# Altium schematic sheet Sheet2.SchDoc
size 420 x 297 mm; Author: ALTIUM GOSTBOM2.0 KEV; SheetNumber: 1; SheetTotal: 1; Наименование1: Логический анализатор; Наименование2: интерфейсов физического; Наименование3: уровня; Вид_документа_SCH: Схема электрическая принципиальная; Обозначение_Код: ТОИУ.001002.001 Э3
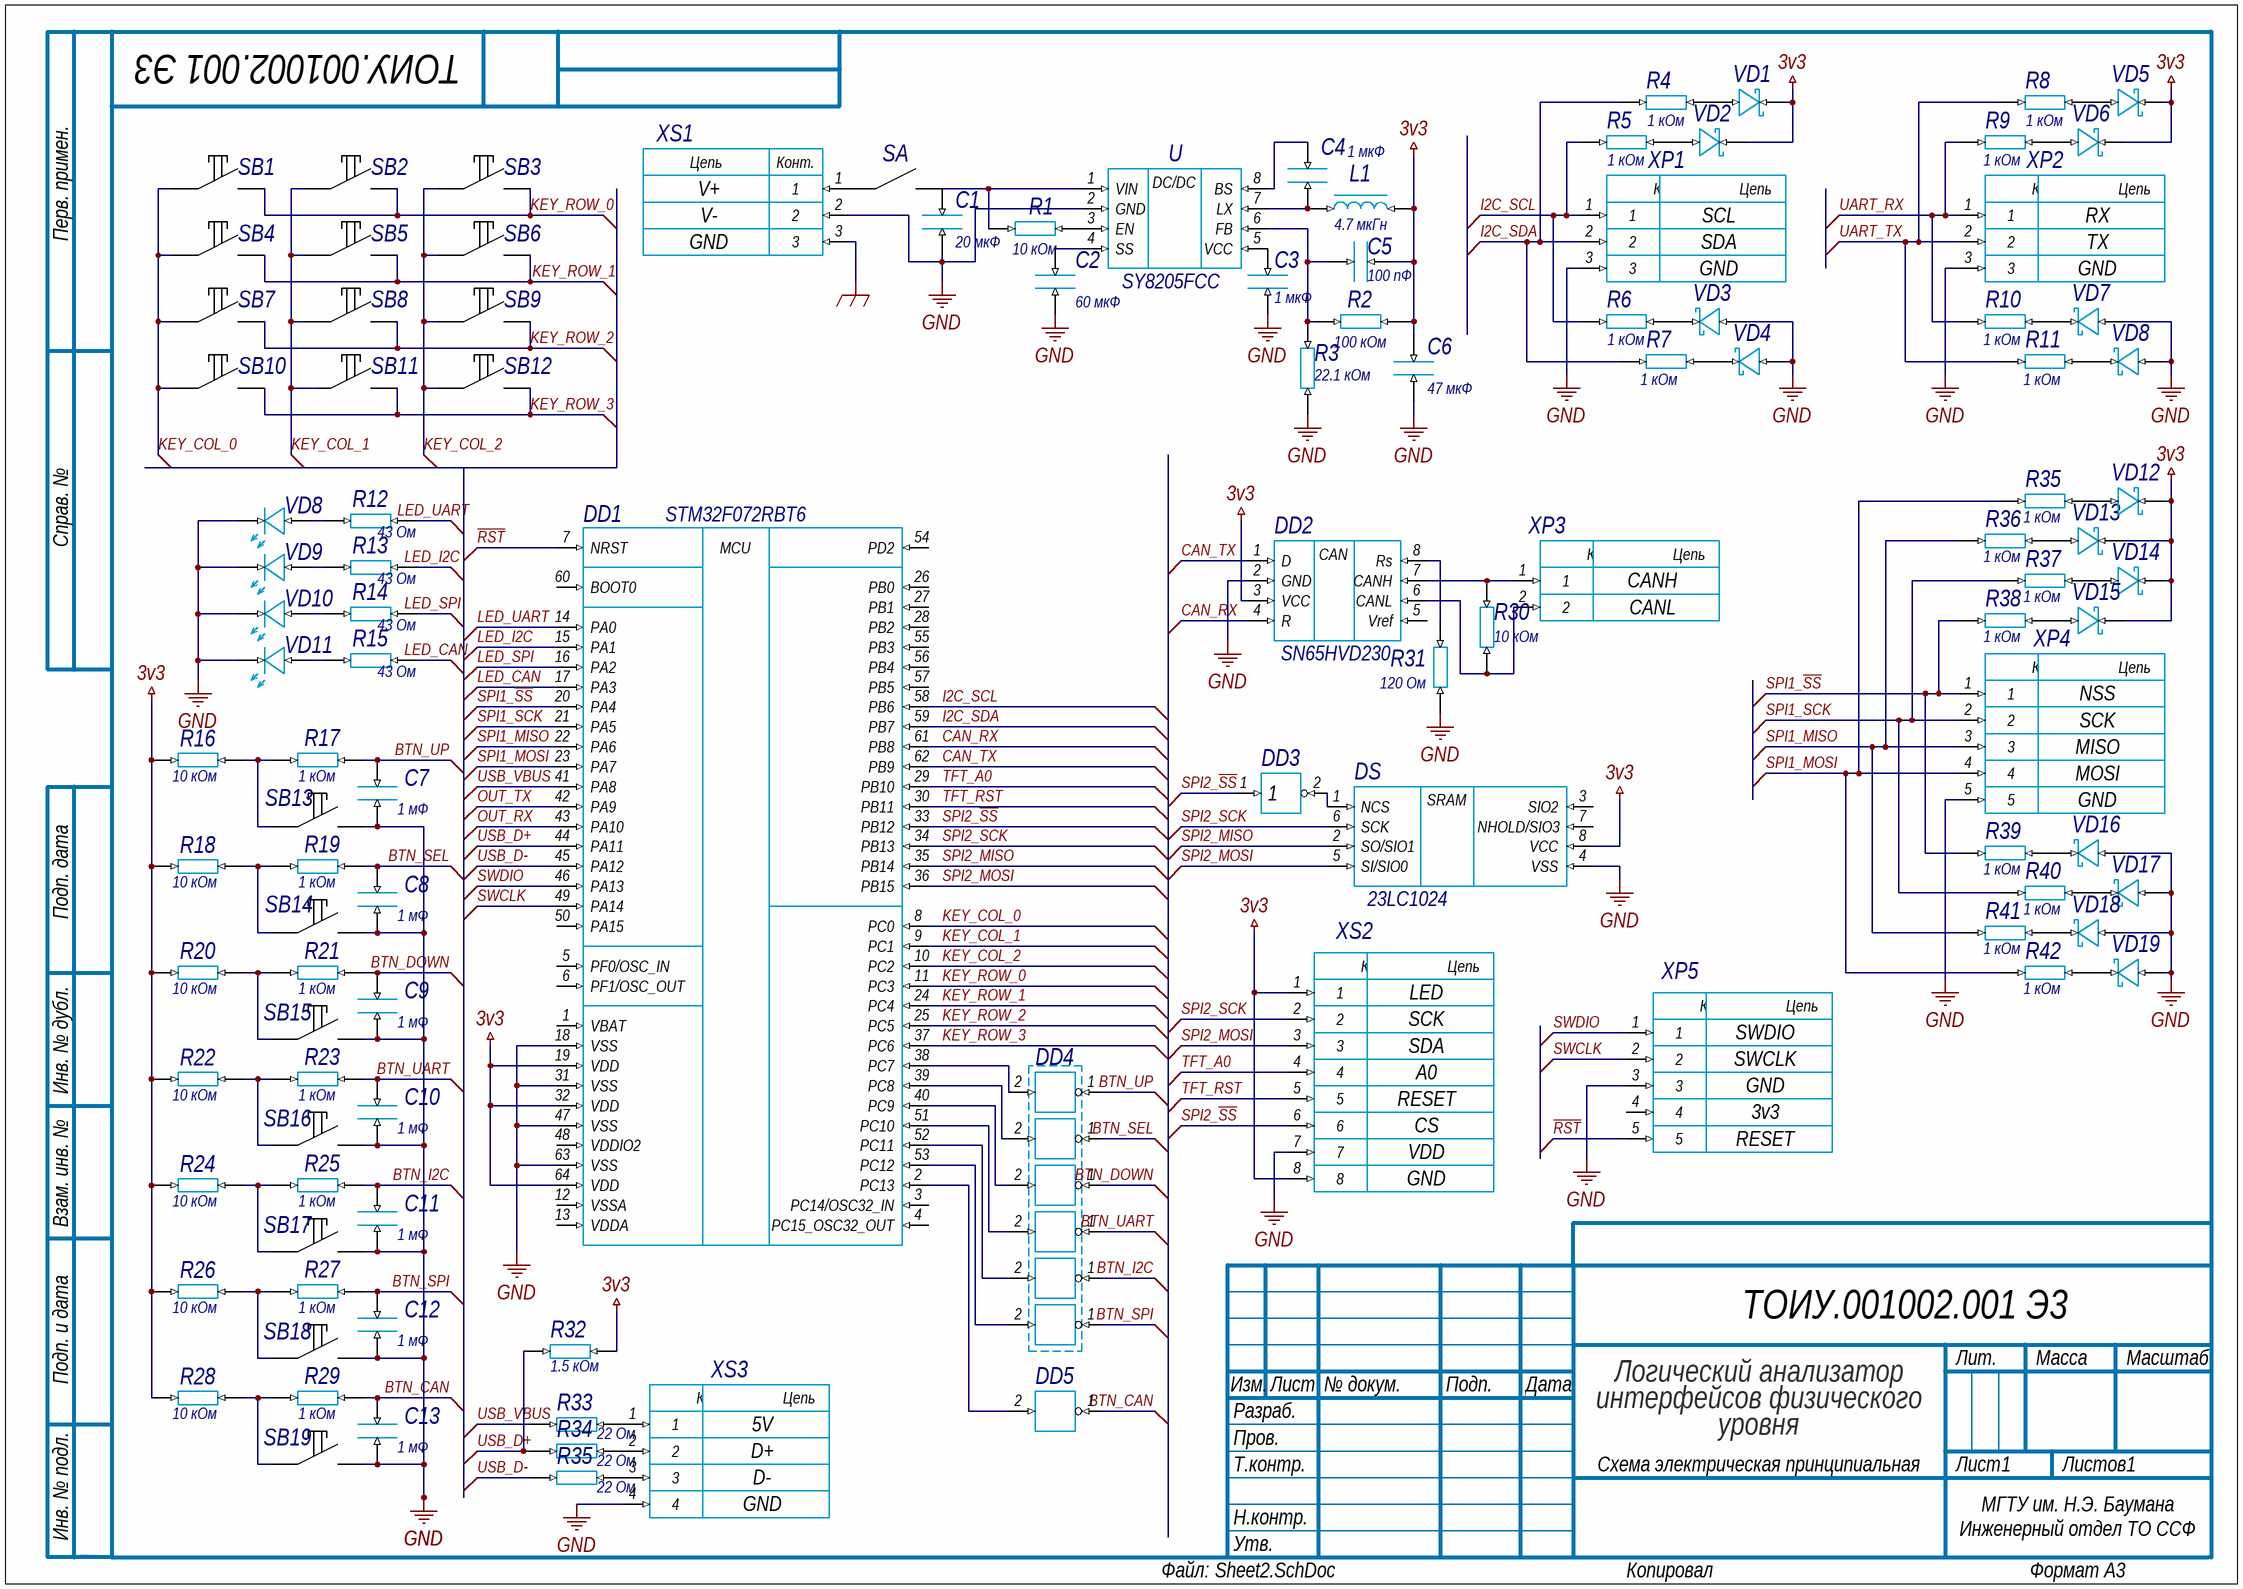
[diagram p0: Sheet2.SchDoc]

## Parts
(Parts that share a designator on the sheet are numbered #1, #2 ... from top to bottom, then left to right.)
C4  1 мкФ
C5  100 пФ
C6  47 мкФ
C7  1 мФ
C8  1 мФ
C9  1 мФ
C10  1 мФ
C11  1 мФ
C12  1 мФ
C13  1 мФ
DD1  STM32F072RBT6  [STM32F072 TQFP64]
DD2  SN65HVD230  [SN65HVD230]
DD3  Обозначение при заказе  (value not drawn)
DD4  Обозначение при заказе  (value not drawn)
DD5  Обозначение при заказе  (value not drawn)
DS  23LC1024  [23A1024]
L1  4.7 мкГн
R1  10 кОм
R2  100 кОм
R3  22.1 кОм
R4  1 кОм
R5  1 кОм
R6  1 кОм
R7  1 кОм
R8  1 кОм
R9  1 кОм
R10  1 кОм
R11  1 кОм
R12  43 Ом
R13  43 Ом
R14  43 Ом
R15  43 Ом
R16  10 кОм
R17  1 кОм
R18  10 кОм
R19  1 кОм
R20  10 кОм
R21  1 кОм
R22  10 кОм
R23  1 кОм
R24  10 кОм
R25  1 кОм
R26  10 кОм
R27  1 кОм
R28  10 кОм
R29  1 кОм
R30  10 кОм
R31  120 Ом
R32  1.5 кОм
R33  22 Ом
R34  22 Ом
R35#1  1 кОм
R35#2  22 Ом
R36  1 кОм
R37  1 кОм
R38  1 кОм
R39  1 кОм
R40  1 кОм
R41  1 кОм
R42  1 кОм
SA  Ключ  (value not drawn)
SB1  Кнопка замыкающая  (value not drawn)
SB2  Кнопка замыкающая  (value not drawn)
SB3  Кнопка замыкающая  (value not drawn)
SB4  Кнопка замыкающая  (value not drawn)
SB5  Кнопка замыкающая  (value not drawn)
SB6  Кнопка замыкающая  (value not drawn)
SB7  Кнопка замыкающая  (value not drawn)
SB8  Кнопка замыкающая  (value not drawn)
SB9  Кнопка замыкающая  (value not drawn)
SB10  Кнопка замыкающая  (value not drawn)
SB11  Кнопка замыкающая  (value not drawn)
SB12  Кнопка замыкающая  (value not drawn)
SB13  Кнопка замыкающая  (value not drawn)
SB14  Кнопка замыкающая  (value not drawn)
SB15  Кнопка замыкающая  (value not drawn)
SB16  Кнопка замыкающая  (value not drawn)
SB17  Кнопка замыкающая  (value not drawn)
SB18  Кнопка замыкающая  (value not drawn)
SB19  Кнопка замыкающая  (value not drawn)
U  SY8205FCC  [SY8205FCC SOP8]
VD1  Обозначение при заказе  (value not drawn)
VD2  Обозначение при заказе  (value not drawn)
VD3  Обозначение при заказе  (value not drawn)
VD4  Обозначение при заказе  (value not drawn)
VD5  Обозначение при заказе  (value not drawn)
VD6  Обозначение при заказе  (value not drawn)
VD7  Обозначение при заказе  (value not drawn)
VD8#1  Обозначение при заказе  (value not drawn)
VD8#2  Обозначение при заказе  (value not drawn)
VD9  Обозначение при заказе  (value not drawn)
VD10  Обозначение при заказе  (value not drawn)
VD11  Обозначение при заказе  (value not drawn)
VD12  Обозначение при заказе  (value not drawn)
VD13  Обозначение при заказе  (value not drawn)
VD14  Обозначение при заказе  (value not drawn)
VD15  Обозначение при заказе  (value not drawn)
VD16  Обозначение при заказе  (value not drawn)
VD17  Обозначение при заказе  (value not drawn)
VD18  Обозначение при заказе  (value not drawn)
VD19  Обозначение при заказе  (value not drawn)
X?#1  Обозначение при заказе  (value not drawn)
X?#2  Обозначение при заказе  (value not drawn)
X?#3  Обозначение при заказе  (value not drawn)
X?#4  Обозначение при заказе  (value not drawn)
X?#5  Обозначение при заказе  (value not drawn)
XP1  Обозначение при заказе  (value not drawn)
XP2  Обозначение при заказе  (value not drawn)
XP3  Обозначение при заказе  (value not drawn)
XP4  Обозначение при заказе  (value not drawn)
XP5  Обозначение при заказе  (value not drawn)
XS1  Обозначение при заказе  (value not drawn)
XS2  Обозначение при заказе  (value not drawn)
XS3  Обозначение при заказе  (value not drawn)
С1  20 мкФ
С2  60 мкФ
С3  1 мкФ

## Nets
3v3: C5.2 C6.2 DD1.19(VDD) DD1.32(VDD) DD1.64(VDD) DD2.3(VCC) DS.8(VCC) L1.1 R2.1 R16.1 R18.1 R20.1 R22.1 R24.1 R26.1 R28.1 R32.2 VD1.1 VD2.1 VD5.1 VD6.1 VD12.1 VD13.1 VD14.1 VD15.1 XS2.1 XS2.8
GND: C6.1 C7.1 C8.1 C9.1 C10.1 C11.1 C12.1 C13.1 DD1.18(VSS) DD1.31(VSS) DD1.47(VSS) DD1.63(VSS) DD2.2(GND) DS.4(VSS) R3.2 R31.2 U.2(GND) VD3.2 VD4.2 VD7.2 VD8#1.2 VD8#2.1 VD9.1 VD10.1 VD11.1 VD16.2 VD17.2 VD18.2 VD19.2 XP1.3 XP2.3 XP4.5 XP5.3 XS1.2 XS2.7 XS3.4 С1.1 С2.1 С3.1
BTN_CAN: C13.2 DD5.1 R29.1
BTN_DOWN: C9.2 R21.1 X?#2.1
BTN_I2C: C11.2 R25.1 X?#4.1
BTN_SEL: C8.2 R19.1 X?#1.1
BTN_SPI: C12.2 R27.1 X?#5.1
BTN_UART: C10.2 R23.1 X?#3.1
BTN_UP: C7.2 DD4.1 R17.1
CAN_RX: DD1.61(PB8) DD2.4(R)
CAN_TX: DD1.62(PB9) DD2.1(D)
I2C_SCL: DD1.58(PB6) R5.1 R6.1 XP1.1
I2C_SDA: DD1.59(PB7) R4.1 R7.1 XP1.2
KEY_COL_0: DD1.8(PC0)
KEY_COL_1: DD1.9(PC1)
KEY_COL_2: DD1.10(PC2)
KEY_ROW_0: DD1.11(PC3)
KEY_ROW_1: DD1.24(PC4)
KEY_ROW_2: DD1.25(PC5)
KEY_ROW_3: DD1.37(PC6)
LED_CAN: DD1.17(PA3)
LED_I2C: DD1.15(PA1)
LED_SPI: DD1.16(PA2)
LED_UART: DD1.14(PA0)
OUT_RX: DD1.43(PA10)
OUT_TX: DD1.42(PA9)
~{RST}: DD1.7(NRST) XP5.5
SPI1_MISO: DD1.22(PA6) R36.1 R41.1 XP4.3
SPI1_MOSI: DD1.23(PA7) R35#1.1 R42.1 XP4.4
SPI1_~{SS}: DD1.20(PA4) R38.1 R39.1 XP4.1
SPI1_SCK: DD1.21(PA5) R37.1 R40.1 XP4.2
SPI2_MISO: DD1.35(PB14) DS.2(SO/SIO1)
SPI2_MOSI: DD1.36(PB15) DS.5(SI/SIO0) XS2.3
SPI2_~{SS}: DD1.33(PB12) DD3.1 XS2.6
SPI2_SCK: DD1.34(PB13) DS.6(SCK) XS2.2
SWCLK: DD1.49(PA14) XP5.2
SWDIO: DD1.46(PA13) XP5.1
TFT_A0: DD1.29(PB10) XS2.4
TFT_RST: DD1.30(PB11) XS2.5
UART_RX: R9.1 R10.1 XP2.1
UART_TX: R8.1 R11.1 XP2.2
USB_D+: DD1.44(PA11) R32.1 R34.2
USB_D-: DD1.45(PA12) R35#2.2
USB_VBUS: DD1.41(PA8) R33.2
NetC4_1: C4.1 L1.2 U.7(LX)
NetC4_2: C4.2 U.8(BS)
NetC5_1: C5.1 R2.2 R3.1 U.6(FB)
NetDD1_2: DD1.2(PC13) DD5.2
NetDD1_38: DD1.38(PC7) DD4.2
NetDD1_39: DD1.39(PC8) X?#1.2
NetDD1_40: DD1.40(PC9) X?#2.2
NetDD1_51: DD1.51(PC10) X?#3.2
NetDD1_52: DD1.52(PC11) X?#4.2
NetDD1_53: DD1.53(PC12) X?#5.2
NetDD2_6: DD2.6(CANL) R30.2 XP3.2
NetDD2_7: DD2.7(CANH) R30.1 XP3.1
NetDD2_8: DD2.8(Rs) R31.1
NetDD3_2: DD3.2 DS.1(NCS)
NetR1_1: R1.1 U.3(EN)
NetR1_2: R1.2 U.1(VIN) С1.2
NetR4_2: R4.2 VD1.2
NetR5_2: R5.2 VD2.2
NetR6_2: R6.2 VD3.1
NetR7_2: R7.2 VD4.1
NetR8_2: R8.2 VD5.2
NetR9_2: R9.2 VD6.2
NetR10_2: R10.2 VD7.1
NetR11_2: R11.2 VD8#1.1
NetR12_2: R12.2 VD8#2.2
NetR13_2: R13.2 VD9.2
NetR14_2: R14.2 VD10.2
NetR15_2: R15.2 VD11.2
NetR16_2: R16.2 R17.2
NetR18_2: R18.2 R19.2
NetR20_2: R20.2 R21.2
NetR22_2: R22.2 R23.2
NetR24_2: R24.2 R25.2
NetR26_2: R26.2 R27.2
NetR28_2: R28.2 R29.2
NetR33_1: R33.1 XS3.1
NetR34_1: R34.1 XS3.2
NetR35#1_2: R35#1.2 VD12.2
NetR35#2_1: R35#2.1 XS3.3
NetR36_2: R36.2 VD13.2
NetR37_2: R37.2 VD14.2
NetR38_2: R38.2 VD15.2
NetR39_2: R39.2 VD16.1
NetR40_2: R40.2 VD17.1
NetR41_2: R41.2 VD18.1
NetR42_2: R42.2 VD19.1
NetU_4: U.4(SS) С2.2
NetU_5: U.5(VCC) С3.2

Not connected (* = marked no-connect by the designer): DD1 1(VBAT) 3(PC14/OSC32_IN) 4(PC15_OSC32_OUT) 5(PF0/OSC_IN) 6(PF1/OSC_OUT) 12(VSSA) 13(VDDA) 26(PB0) 27(PB1) 28(PB2) 48(VDDIO2) 50(PA15) 54(PD2) 55(PB3) 56(PB4) 57(PB5) 60(BOOT0); DD2 5(Vref); DS 3(SIO2) 7(NHOLD/SIO3); R12 1; R13 1; R14 1; R15 1; XP5 4; XS1 1 3

## Notes on the sheet
- МГТУ им. Н.Э. Баумана
  Инженерный отдел ТО ССФ ИУ
- Labels drawn without touching a wire or pin: LED_CAN, LED_I2C, LED_SPI, LED_UART
- Перв. примен.
- Справ. №
- Подп. дата
- Инв. № дубл.
- Взам. инв. №
- Подп. и дата
- Изм.
- Разраб.
- Лист
- № докум.
- Подп.
- Дата
- Лит.
- Масса
- Масштаб
- Пров.
- Т.контр.
- Листов
- Инв. № подл.
- Н.контр.
- Утв.
- ALTIUM GOSTBOM2.0 KEV
- Файл:
- Копировал
- Формат А3
- (in symbol 23LC1024) SRAM
- (in symbol SN65HVD230) CAN
- (in symbol STM32F072) MCU
- (in symbol SY8205FCC) DC/DC
- (in symbol Гнездо 2 контакта левое) Конт.; Цепь
- (in symbol Гнездо 3 контакта) Конт.; Цепь
- (in symbol Гнездо 4 контакта левое) Конт.; Цепь
- (in symbol Гнездо 5 контактов) Конт.; Цепь
- (in symbol Гнездо 8 контактов) Конт.; Цепь

## Library data of the parts
C4-C13 С1-С3 = Конденсатор: Описание свойств компонента
DD1 = STM32F072: Описание свойств компонента
DD2 = SN65HVD230: CAN-трансивер 3.3В
DD3 = Инвертор: Описание свойств компонента
DD4 DD5 X?#1-X?#5 = Триггер Шмидта: Описание свойств компонента
DS = 23LC1024: SPI SRAM
L1 = Катушка с сердечником: Описание свойств компонента
R1-R34 R35#1 R35#2 R36-R42 = Резистор: Описание свойств компонента
U = SY8205FCC: Понижающий преобразователь
VD1-VD7 VD8#1 VD12-VD19 = Диод Шоттки: Описание свойств компонента
VD8#2 VD9-VD11 = Светодиод: Описание свойств компонента
XP1 = Гнездо 3 контакта: Описание свойств компонента; NET_1: SCL; NET_2: SDA; NET_3: GND
XP2 = Гнездо 3 контакта: Описание свойств компонента; NET_1: RX; NET_2: TX; NET_3: GND
XP3 = Гнездо 2 контакта левое: Описание свойств компонента; NET_1: CANH; NET_2: CANL
XP4 = Гнездо 5 контактов: NET_1: NSS; NET_2: SCK; NET_3: MISO; NET_4: MOSI; NET_5: GND
XP5 = Гнездо 5 контактов: NET_1: SWDIO; NET_2: SWCLK; NET_3: GND; NET_4: 3v3; NET_5: RESET
XS1 = Гнездо 3 контакта: Описание свойств компонента; NET_1: V+; NET_2: V-; NET_3: GND
XS2 = Гнездо 8 контактов: NET_1: LED; NET_2: SCK; NET_3: SDA; NET_4: A0; NET_5: RESET; NET_6: CS; NET_7: VDD; NET_8: GND
XS3 = Гнездо 4 контакта левое: NET_1: 5V; NET_2: D+; NET_3: D-; NET_4: GND